# EAGLE design DFPLayerAudio (EAGLE 9.6.2)
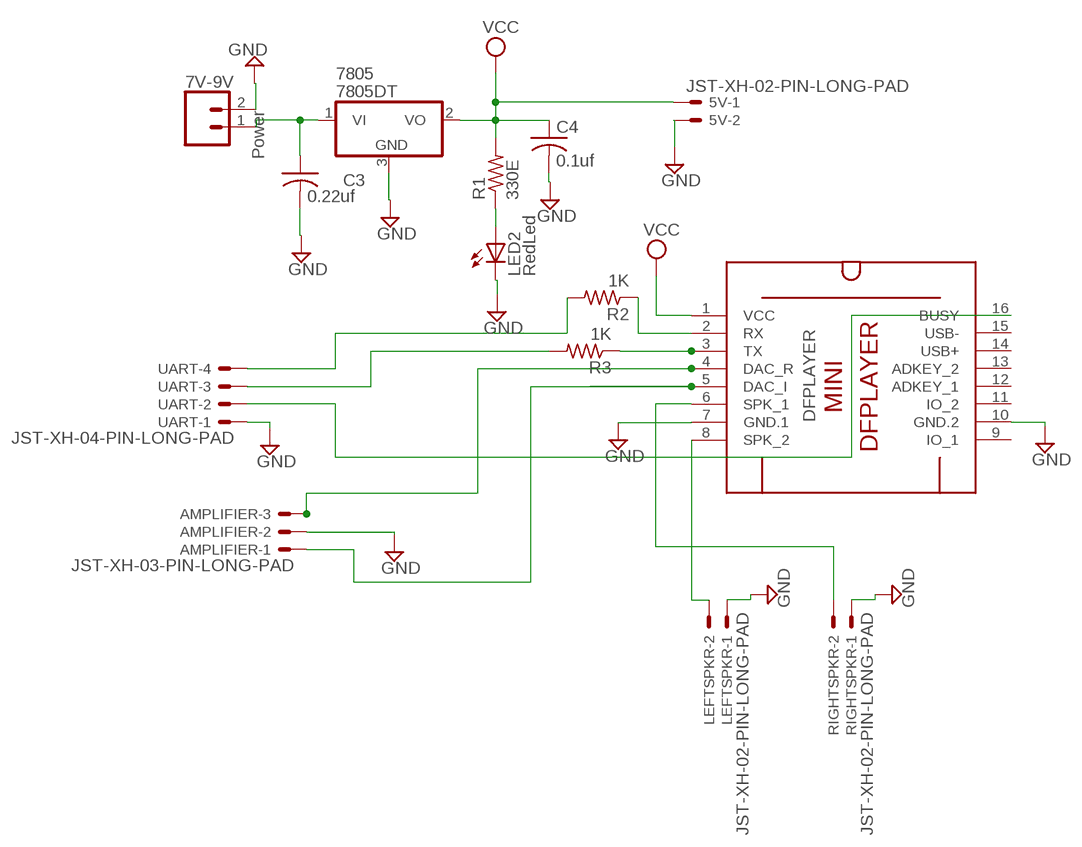
[diagram p0: schematic, sheet 1]

## Parts
5V  JST-XH-02-PIN-LONG-PAD  [JST-XH-02-PACKAGE-LONG-PAD]
7V-9V  Power  CONN_025MM  [SCREWTERMINAL-5MM-2]
7805  7805DT  [TO252]
AMPLIFIER  JST-XH-03-PIN-LONG-PAD  [JST-XH-03-PACKAGE-LONG-PAD]
C3  0.22uf  C-USC0805K  [C0805K]
C4  0.1uf  C-USC0805K  [C0805K]
DFPLAYER  DFPLAYER-MINI-MODULE  [DFPLAYER-MINI-MODULE]
LED2  RedLed  LEDCHIPLED_0805  [CHIPLED_0805]
LEFTSPKR  JST-XH-02-PIN-LONG-PAD  [JST-XH-02-PACKAGE-LONG-PAD]
R1  330E  R-US_M0805  [M0805]
R2  1K  R-US_M0805  [M0805]
R3  1K  R-US_M0805  [M0805]
RIGHTSPKR  JST-XH-02-PIN-LONG-PAD  [JST-XH-02-PACKAGE-LONG-PAD]
UART  JST-XH-04-PIN-LONG-PAD  [JST-XH-04-PACKAGE-LONG-PAD]

## Nets
GND: 5V.2 7V-9V.2 7805.3(GND) AMPLIFIER.2 C3.2 C4.2 DFPLAYER.7(GND.1) DFPLAYER.10(GND.2) LED2.C LEFTSPKR.1 RIGHTSPKR.1 UART.1
N$1: AMPLIFIER.3 DFPLAYER.4(DAC_R)
N$3: 7V-9V.1 7805.1(VI) C3.1
N$4: DFPLAYER.3(TX) R3.1
N$5: DFPLAYER.2(RX) R2.1
N$6: DFPLAYER.16(BUSY) UART.2
N$7: R3.2 UART.3
N$8: R2.2 UART.4
N$12: DFPLAYER.8(SPK_2) LEFTSPKR.2
N$14: AMPLIFIER.1 DFPLAYER.5(DAC_I)
N$15: LED2.A R1.1
N$19: DFPLAYER.6(SPK_1) RIGHTSPKR.2
VCC: 5V.1 7805.2(VO) C4.1 DFPLAYER.1(VCC) R1.2
Unconnected: DFPLAYER.9(IO_1) DFPLAYER.11(IO_2) DFPLAYER.12(ADKEY_1) DFPLAYER.13(ADKEY_2) DFPLAYER.14(USB+) DFPLAYER.15(USB-)

## Library data of the parts
5V LEFTSPKR RIGHTSPKR = Rembrandt Electronics - JST XH Connectors v1-0:JST-XH-02-PIN: JST XH Connector 2 Pin Wire to board connector. Pitch: 2,54 mm, (0.100") Number of pins: 2 Created by Rembrandt Electronics www.rembrandtelectronics.com
7V-9V = SparkFun-Connectors:CONN_02: Multi connection point. Often used as Generic Header-pin footprint for 0.1 inch spaced/style header connections On any of the 0.1 inch spaced packages, you can populate with these: Break Away Headers - Straight <https://www.sparkfun.com/products/116> (PRT-00116) Break Away Male Headers - Right Angle <https://www.sparkfun.com/products/553> (PRT-00553) Female Headers <https://www.sparkfun.com/products/115> (PRT-00115) Break Away Headers - Machine Pin <https://www.sparkfun.com/products/117> (PRT-00117) Break Away Female Headers - Swiss Machine Pin <https://www.sparkfun.com/products/743> (PRT-00743) For SCREWTERMINALS and SPRING TERMINALS visit here: Screw Terimnals on SparkFun.com <https://www.sparkfun.com/search/results?term=Screw+Terminals> (5mm/3.5mm/2.54mm spacing) This device is also useful as a general connection point to wire up your design to another part of your project. Our various solder wires solder well into these plated through hole pads. Hook-Up Wire - Assortment (Stranded, 22 AWG) <https://www.sparkfun.com/products/11375> (PRT-11375) Hook-Up Wire - Assortment (Solid Core, 22 AWG) <https://www.sparkfun.com/products/11367> (PRT-11367) View the entire wire category on our website here <https://www.sparkfun.com/categories/141> Special notes: Molex polarized connector foot print use with: PRT-08233 with associated crimp pins and housings. 2.54_SCREWTERM for use with PRT-10571. 3.5mm Screw Terminal footprints for PRT-08084 5mm Screw Terminal footprints for use with PRT-08432; SF_SKU: PRT-08432
7805 = adafruit:78*: Positive VOLTAGE REGULATOR Added bigger pads to the TO-92 package
AMPLIFIER = Rembrandt Electronics - JST XH Connectors v1-0:JST-XH-03-PIN: JST XH Connector 2 Pin Wire to board connector. Pitch: 2,54 mm, (0.100") Number of pins: 3 Created by Rembrandt Electronics www.rembrandtelectronics.com
C3 C4 = adafruit:C-US: CAPACITOR, American symbol
DFPLAYER = diy-modules:DFPLAYER-MINI-MODULE: DFPlayer Mini - MP3 player module based on YX5200 chip More details available here: https://www.dfrobot.com/wiki/index.php/DFPlayer_Mini_SKU:DFR0299 Click here to find device on ebay.com <http://www.ebay.com/sch/dfplayer+mini>
LED2 = adafruit:LED: LED OSRAM: - CHIPLED LG R971, LG N971, LY N971, LG Q971, LY Q971, LO R971, LY R971 LH N974, LH R974 LS Q976, LO Q976, LY Q976 LO Q996 - Hyper CHIPLED LW Q18S LB Q993, LB Q99A, LB R99A - SideLED LS A670, LO A670, LY A670, LG A670, LP A670 LB A673, LV A673, LT A673, LW A673 LH A674 LY A675 LS A676, LA A676, LO A676, LY A676, LW A676 LS A679, LY A679, LG A679 - Hyper Micro SIDELED® LS Y876, LA Y876, LO Y876, LY Y876 LT Y87S - SmartLED LW L88C, LW L88S LB L89C, LB L89S, LG L890 LS L89K, LO L89K, LY L89K LS L896, LA L896, LO L896, LY L896 - TOPLED LS T670, LO T670, LY T670, LG T670, LP T670 LSG T670, LSP T670, LSY T670, LOP T670, LYG T670 LG T671, LOG T671, LSG T671 LB T673, LV T673, LT T673, LW T673 LH T674 LS T676, LA T676, LO T676, LY T676, LB T676, LH T676, LSB T676, LW T676 LB T67C, LV T67C, LT T67C, LS T67K, LO T67K, LY T67K, LW E67C LS E67B, LA E67B, LO E67B, LY E67B, LB E67C, LV E67C, LT E67C LW T67C LS T679, LY T679, LG T679 LS T770, LO T770, LY T770, LG T770, LP T770 LB T773, LV T773, LT T773, LW T773 LH T774 LS E675, LA E675, LY E675, LS T675 LS T776, LA T776, LO T776, LY T776, LB T776 LHGB T686 LT T68C, LB T68C - Hyper Mini TOPLED® LB M676 - Mini TOPLED Santana® LG M470 LS M47K, LO M47K, LY M47K Source: http://www.osram.convergy.de/
R1-R3 = adafruit:R-US_: RESISTOR, American symbol
UART = Rembrandt Electronics - JST XH Connectors v1-0:JST-XH-04-PIN: JST XH Connector 2 Pin Wire to board connector. Pitch: 2,54 mm, (0.100") Number of pins: 4 Created by Rembrandt Electronics www.rembrandtelectronics.com

## Board
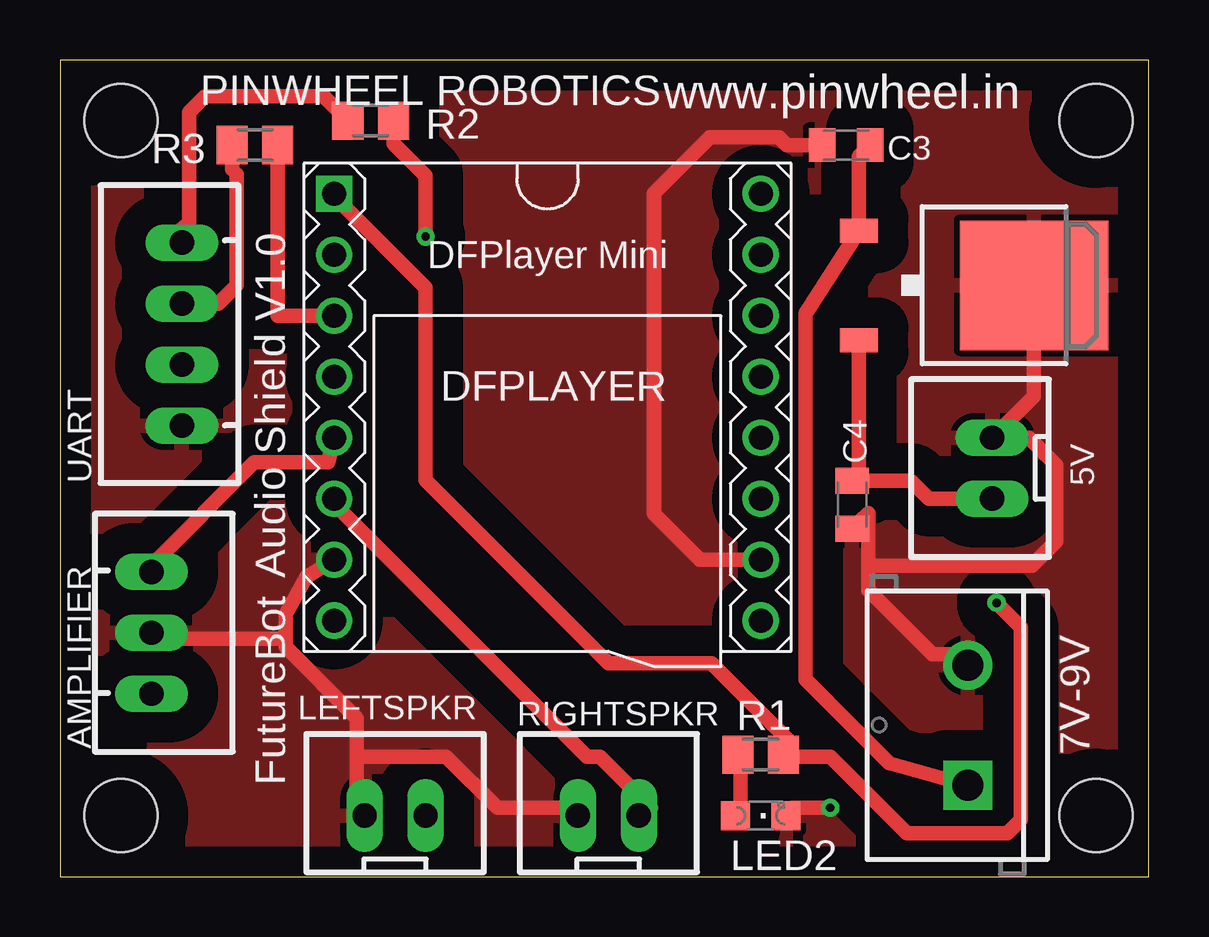
[diagram p1: board, top side]
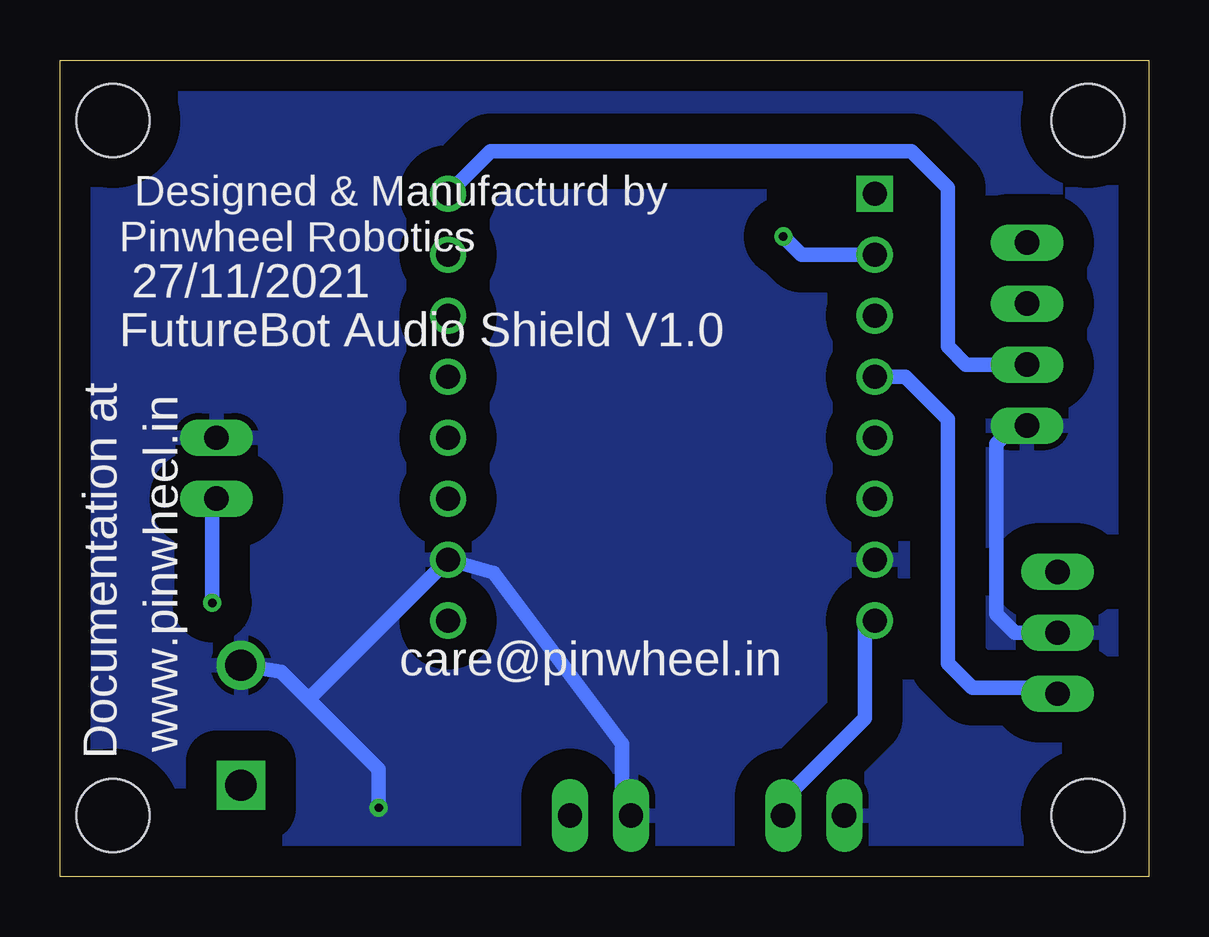
[diagram p2: board, bottom side, seen from below]

Size 45.39 x 34.03 mm. Coordinates in mm from the lower left corner, seen from the top.
Outline: 0,0 45.39,0 45.39,34.03 0,34.03 0,0
Copper layers (1*16): Top 0.035mm / dielectric 1.5mm / Bottom 0.035mm
Design rules "default *": minimum track width 24mil, minimum drill 0.35mm, track to track 18mil, track to pad 18mil, pad to pad 18mil, via to via 18mil, smd to smd 18mil, copper to edge 40mil, drill to drill 20mil, minimum pad ring 10mil, minimum via ring 8mil, stop-mask expansion 4mil, vias tented up to drill 0mil, thermal gap 10mil
Holes 3.05 mm at 2.54,31.5 2.54,2.54 43.18,31.5 43.18,2.54

### Footprints (pad centres in the part's own frame; a part is rotated, then mirrored left to right if it is on the bottom)
JST-XH-02-PACKAGE-LONG-PAD = drill 1.016 long: 1 -1.27,0; 2 1.27,0
SCREWTERMINAL-5MM-2 = drill 1.3 pad 2.032 square: 1 0,0 | drill 1.3 pad 2.032: 2 5,0
TO252 = smd 1 x 1.6: 1 -2.28,-4.8; 2 2.28,-4.8 | smd 5.4 x 6.2: 3 0,2.5
JST-XH-03-PACKAGE-LONG-PAD = drill 1.016 long: 1 -2.54,0; 2 0,0; 3 2.54,0
C0805K = smd 1.1 x 1.4: 1 -1,0; 2 1,0
DFPLAYER-MINI-MODULE = drill 1 square: 1 -8.89,-8.89 | drill 1: 2 -6.35,-8.89; 3 -3.81,-8.89; 4 -1.27,-8.89; 5 1.27,-8.89; 6 3.81,-8.89; 7 6.35,-8.89; 8 8.89,-8.89; 9 8.89,8.89; 10 6.35,8.89; 11 3.81,8.89; 12 1.27,8.89; 13 -1.27,8.89; 14 -3.81,8.89; 15 -6.35,8.89; 16 -8.89,8.89
CHIPLED_0805 = smd 1.2 x 1.2: A 0,-1.05; C 0,1.05
M0805 = smd 1.3 x 1.6: 1 -0.95,0; 2 0.95,0
JST-XH-04-PACKAGE-LONG-PAD = drill 1.016 long: 1 -3.81,0; 2 -1.27,0; 3 1.27,0; 4 3.81,0

### Placement (x,y rotation side)
5V  38.86,17.02 90 top
7V-9V  37.85,3.81 90 top
7805  38.1,24.64 270 top
AMPLIFIER  3.81,10.16 270 top
C3  32.77,30.48 180 top
C4  33.02,15.49 270 top
DFPLAYER  20.32,19.56 270 top
LED2  29.21,2.54 270 top
LEFTSPKR  13.97,2.54 0 top
R1  29.21,5.08 0 top
R2  12.95,31.5 180 top
R3  8.13,30.48 180 top
RIGHTSPKR  22.86,2.54 0 top
UART  5.08,22.61 90 top

### Tracks (layer width: path | path; a pad name or v marks a point on that pad's centre or on a via)
GND  (via drill 0.35)
  Top 0.61: v32.11,2.87 30.51,2.87 LED2.C | 33.71,12.95 33.71,11.94 36.37,9.27 37.39,9.27 7V-9V.2 | 33.71,12.95 33.71,15.14 C4.2 | C3.2 30.3,30.48 29.97,30.81 27.1,30.81 24.77,28.47 24.77,15.11 26.67,13.21 DFPLAYER.10 | DFPLAYER.7 10.27,12.48 9.4,10.92 9.4,9.91 | 12.37,5 12.37,6.6 9.4,9.58 9.4,9.91 | 12.37,5 12.37,2.87 LEFTSPKR.1 | 12.37,5 16.1,5 18.24,2.87 21.44,2.87 RIGHTSPKR.1 | AMPLIFIER.2 4.06,9.91 9.4,9.91 | 7805.3 40.6,20.03 5V.2 40.39,18.29 41.53,17.14 41.53,13.97 40.51,12.95 33.71,12.95
  Bottom 0.61: v32.11,2.87 32.11,4.47 35.03,7.39 | 35.03,7.39 36.18,8.55 7V-9V.2 | 35.03,7.39 DFPLAYER.10 27.31,12.65 21.97,5.54 21.97,2.87 RIGHTSPKR.1 | UART.1 5.59,18.8 6.35,18.03 6.35,10.92 5.59,10.16 AMPLIFIER.2
  pour Top (isolate 1.27): -0.25,34.29 45.47,34.29 45.47,-0.25 -0.25,-0.25
  pour Bottom (isolate 1.27): 0.25,33.78 44.96,33.78 45.47,33.27 45.47,0.25 -0.25,0.25 -0.25,33.78
N$1
  Bottom 0.61: AMPLIFIER.3 4.06,7.87 7.37,7.87 8.38,8.89 8.38,19.05 10.16,20.83 DFPLAYER.4
N$3
  Top 0.61: C3.1 33.3,30.01 7805.1 31.06,23.46 31.06,8.23 34.57,4.72 7V-9V.1
N$4
  Top 0.61: R3.1 9.08,23.37 DFPLAYER.3
N$5  (via drill 0.35)
  Top 0.61: v15.24,26.67 15.24,29.21 13.9,30.55 R2.1
  Bottom 0.61: v15.24,26.67 14.48,25.91 DFPLAYER.2
N$6
  Bottom 0.61: DFPLAYER.16 27.43,30.23 9.91,30.23 8.38,28.7 8.38,22.1 7.62,21.34 UART.2
N$7
  Top 0.61: R3.2 7.18,29.46 7.37,29.28 7.37,24.64 6.6,23.88 UART.3
N$8
  Top 0.61: R2.2 10.99,32.51 6.05,32.51 5.39,31.84 5.39,27.27 5.08,26.96 UART.4
N$12
  Bottom 0.61: DFPLAYER.8 11.84,10.31 11.84,6.6 15.57,2.87 LEFTSPKR.2
N$14
  Top 0.61: DFPLAYER.5 11.18,17.27 8.1,17.27 3.84,13 AMPLIFIER.1
N$15
  Top 0.61: LED2.A 28.37,2.87 28.37,5 R1.1
N$19
  Top 0.61: DFPLAYER.6 11.5,15.48 21.97,5 22.5,5 24.64,2.87 RIGHTSPKR.2
VCC  (via drill 0.35)
  Top 0.61: 7805.2 33.3,16.77 C4.1 35.47,16.49 36.22,15.75 5V.1 | DFPLAYER.1 11.43,28.35 15.24,24.54 15.24,16.51 22.86,8.89 27.15,8.89 30.51,5.54 R1.2 30.51,5 32.11,5 35.31,1.8 39.5,1.8 40.06,2.36 40.06,10.39 v39.04,11.4
  Bottom 0.61: 5V.1 39.04,15.57 v39.04,11.4

### Text on the board
tNames: www.pinwheel.in | PINWHEEL ROBOTICS | Audio Shield V1.0 | FutureBot
bNames: Designed & Manufacturd by | 27/11/2021 | Pinwheel Robotics | FutureBot Audio Shield V1.0 | www.pinwheel.in | Documentation at | care@pinwheel.in